# Altium schematic sheet Sheet3.SchDoc
size A3
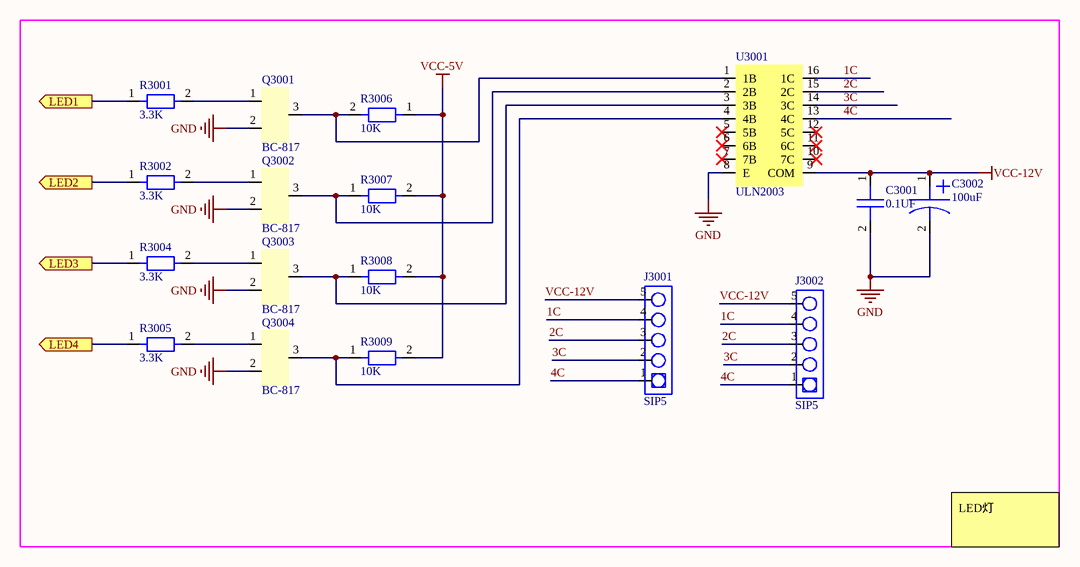
[diagram p0: Sheet3.SchDoc]

## Parts
C3001  0.1UF  [0603]
C3002  100uF  [7343]
J3001  SIP5  [SIP5]
J3002  SIP5  [SIP5]
Q3001  BC-817  [S9013]
Q3002  BC-817  [S9013]
Q3003  BC-817  [S9013]
Q3004  BC-817  [S9013]
R3001  3.3K  [0603]
R3002  3.3K  [0603]
R3004  3.3K  [0603]
R3005  3.3K  [0603]
R3006  10K  [0603]
R3007  10K  [0603]
R3008  10K  [0603]
R3009  10K  [0603]
U3001  ULN2003  [ULN2003A]

## Ports
LED1 (out), LED2 (out), LED3 (out), LED4 (out)

## Nets
GND: C3001.2 C3002.2 Q3001.2 Q3002.2 Q3003.2 Q3004.2 U3001.8(E)
VCC-5V: R3006.1 R3007.2 R3008.2 R3009.2
VCC-12V: C3001.1 C3002.1 J3001.5 J3002.5 U3001.9(COM)
1C: J3001.4 J3002.4 U3001.16(1C)
2C: J3001.3 J3002.3 U3001.15(2C)
3C: J3001.2 J3002.2 U3001.14(3C)
4C: J3001.1 J3002.1 U3001.13(4C)
LED1: R3001.1 ; port LED1
LED2: R3002.1 ; port LED2
LED3: R3004.1 ; port LED3
LED4: R3005.1 ; port LED4
NetQ3001_1: Q3001.1 R3001.2
NetQ3001_3: Q3001.3 R3006.2 U3001.1(1B)
NetQ3002_1: Q3002.1 R3002.2
NetQ3002_3: Q3002.3 R3007.1 U3001.2(2B)
NetQ3003_1: Q3003.1 R3004.2
NetQ3003_3: Q3003.3 R3008.1 U3001.3(3B)
NetQ3004_1: Q3004.1 R3005.2
NetQ3004_3: Q3004.3 R3009.1 U3001.4(4B)

Not connected (* = marked no-connect by the designer): U3001 5(5B)* 6(6B)* 7(7B)* 10(7C)* 11(6C)* 12(5C)*

## Notes on the sheet
- LED灯

## Library data of the parts
C3001 = C
C3002 = 极性电容
R3001 R3002 R3004-R3009 = R